# EAGLE design Eagle_SlidingPotentiometer (EAGLE 6.6.0)
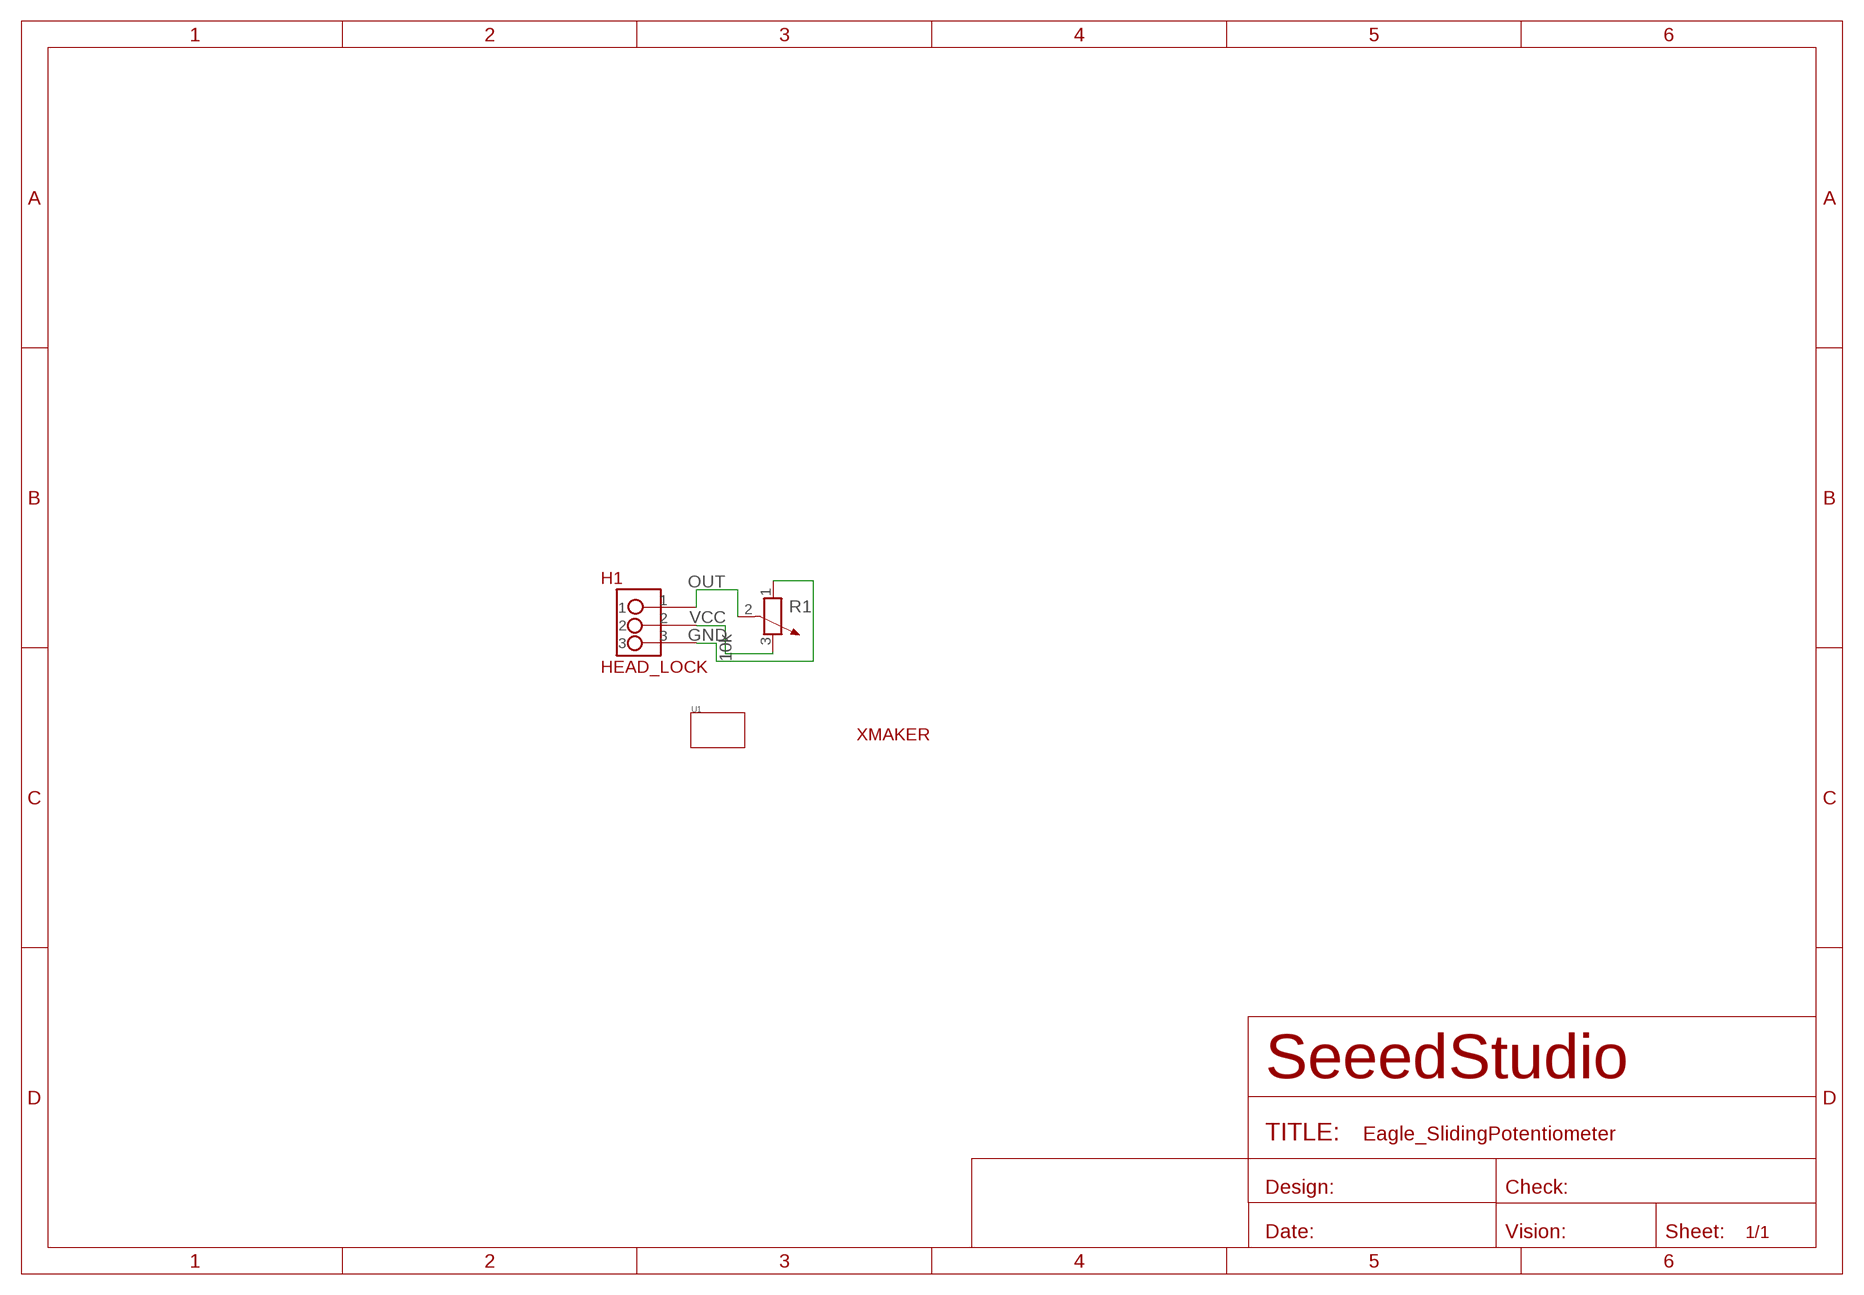
[diagram p0: schematic, sheet 1]

## Parts
H1  HEAD_LOCK  [HEAD_LOCK]
R1  10k  R-POTENTIOMETER  [3P-SQUA-45.6X10X5.8H]
U1  TWIG'3U'  [3U-DIM-W/-DRILL]
U$1  XMAKERLOGO2  [XMAKERLOGO2]

## Nets
GND: H1.3 R1.1
OUT: H1.1 R1.2
VCC: H1.2 R1.3

## Library data of the parts
H1 = HEAD_LOCK:HEAD_LOCK: 带锁的排座
R1 = Discrete:R-POTENTIOMETER*: Potentiometer
U1 = Module:TWIG
U$1 = Xmaker_yuhui:XMAKERLOGO2

## Board
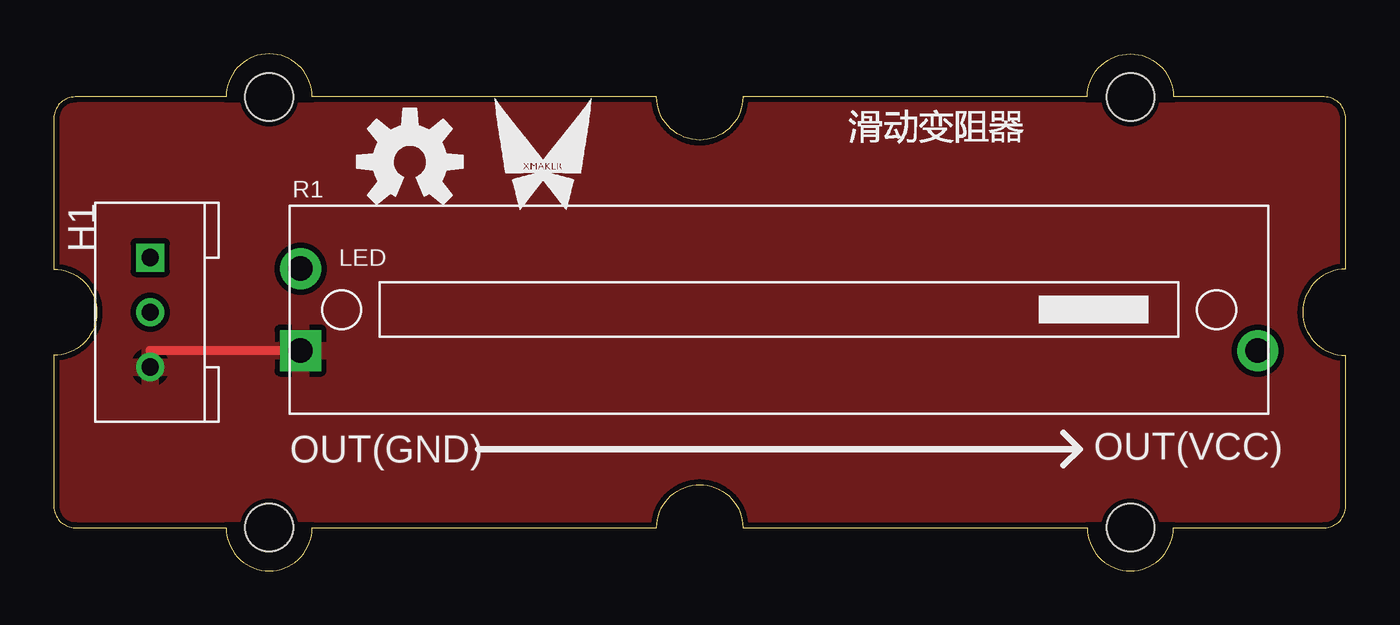
[diagram p1: board, top side]
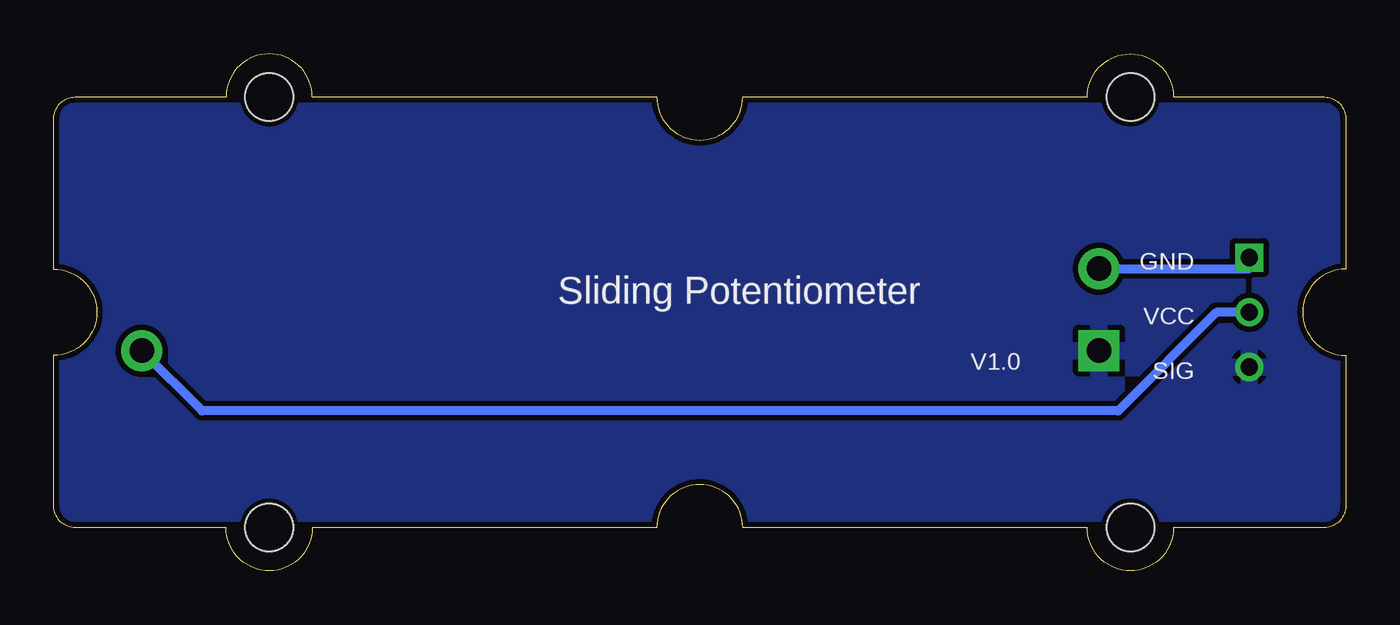
[diagram p2: board, bottom side, seen from below]

Size 60 x 24 mm. Coordinates in mm from the lower left corner, seen from the top.
Copper layers (1*16): Top 0.035mm / dielectric 1.5mm / Bottom 0.035mm
Design rules "default": minimum track width 6mil, minimum drill 12mil, track to track 6mil, track to pad 6mil, pad to pad 6mil, via to via 6mil, smd to smd 6mil, copper to edge 10mil, drill to drill 10mil, minimum pad ring 10mil, minimum via ring 8mil, stop-mask expansion 2mil, vias tented up to drill 100mil, thermal gap 10mil

### Footprints (pad centres in the part's own frame; a part is rotated, then mirrored left to right if it is on the bottom)
HEAD_LOCK = drill 0.8 square: 1 0,0 | drill 0.8: 2 2.54,0; 3 5.08,0
3P-SQUA-45.6X10X5.8H = drill 1.143 pad 1.905 square: 1 -22.225,-1.905 | drill 1.143 pad 1.905: 2 -22.225,1.905; 3 22.225,-1.905
3U-DIM-W/-DRILL = hole 2.2: -20,10; -20,-10; 20,10; 20,-10

### Placement (x,y rotation side)
H1  4.47,14.54 270 top
R1  33.68,12.13 0 top
U1  30,12 0 top
U$1  19.2,15.81 0 top
U$3  [OPENHARDWARE]  16.54,18.99 0 top

### Tracks (layer width: path | path; a pad name or v marks a point on that pad's centre or on a via)
GND
  Top 0.406: R1.1 4.47,10.22 H1.3
  pour Bottom (isolate 0.254): -3.15,25.08 -3.15,-2.86 62.89,-2.86 62.89,-1.59 62.89,26.35 -3.15,26.35
  pour Top (isolate 0.254): -0.61,-1.59 61.62,-1.59 61.62,25.08 -1.88,25.08 -1.88,-1.59
OUT
  Bottom 0.406: R1.2 4.47,14.03 H1.1
VCC
  Bottom 0.406: H1.2 6,12 10.57,7.43 53.11,7.43 R1.3

### Text on the board
tPlace: OUT(VCC) | OUT(GND)
bPlace: GND | VCC | Sliding Potentiometer | SIG | V1.0
tNames: LED